# EAGLE design PiGateway2_2 (EAGLE 7.6.0)
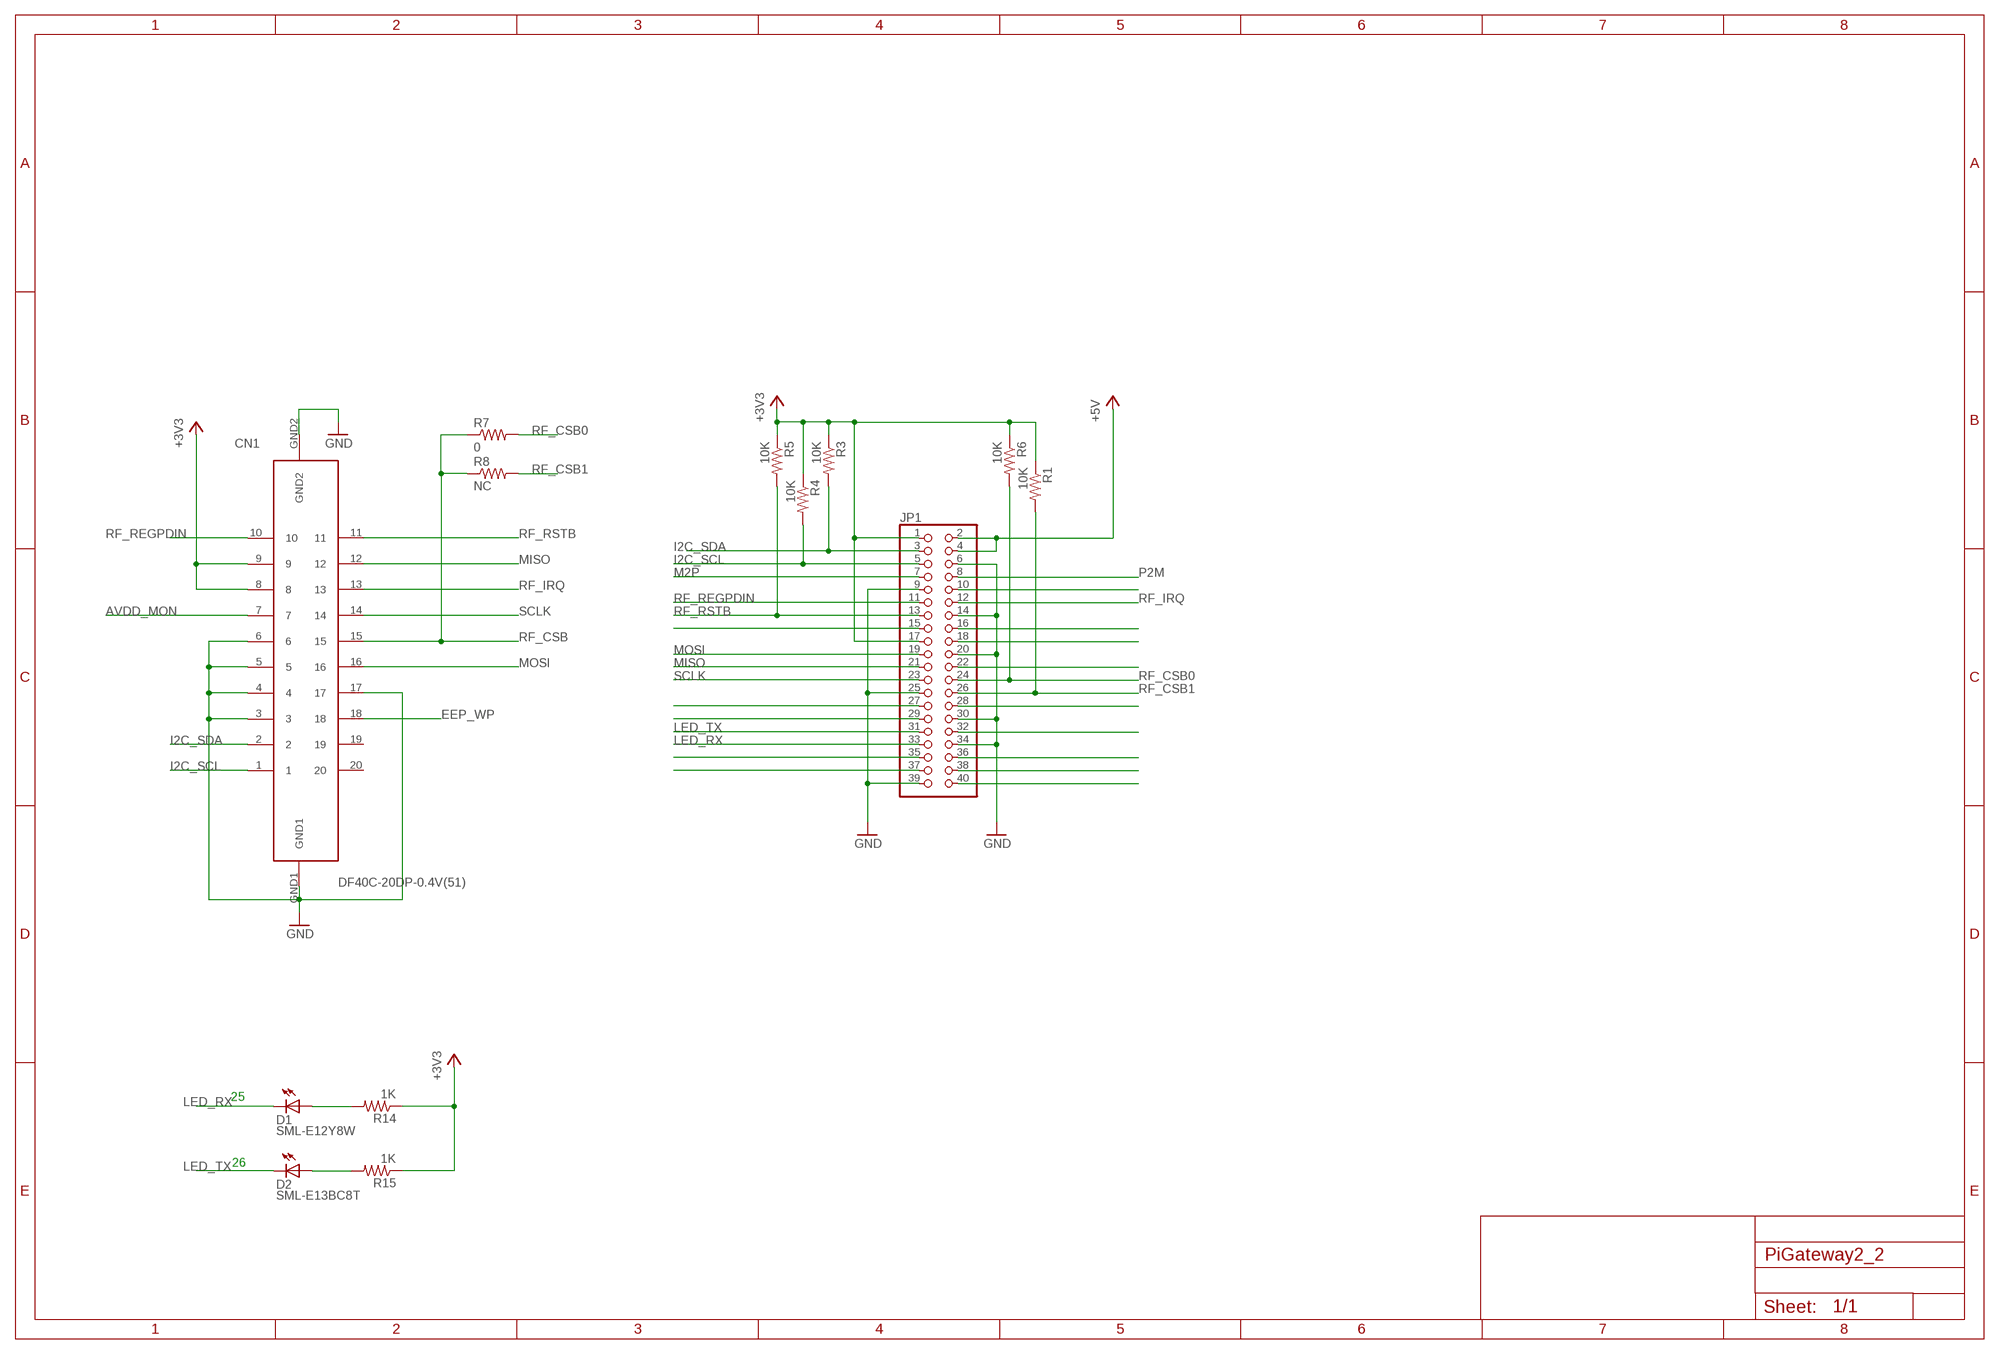
[diagram p0: schematic, sheet 1]

## Parts
CN1  DF40C-20DP-0.4V(51)  BP3596A  [BP3596A]
D1  SML-E12Y8W  SML-E1X  [SML-E1X]
D2  SML-E13BC8T  SML-E1X  [SML-E1X]
JP1  PINHD-2X20  [2X20]
R1  10K  R-US_R0402  [R0402]
R3  10K  R-US_R0402  [R0402]
R4  10K  R-US_R0402  [R0402]
R5  10K  R-US_R0402  [R0402]
R6  10K  R-US_R0402  [R0402]
R7  0  R-US_R0402  [R0402]
R8  NC  R-US_R0402  [R0402]
R14  1K  R-US_R0402  [R0402]
R15  1K  R-US_R0402  [R0402]

## Nets
+3V3: CN1.8 CN1.9 JP1.1 JP1.17 R1.1 R3.1 R4.1 R5.1 R6.1 R14.1 R15.1
+5V: JP1.2 JP1.4
AVDD_MON: CN1.7
EEP_WP: CN1.18
GND: CN1.3 CN1.4 CN1.5 CN1.6 CN1.17 CN1.GND1 CN1.GND2 JP1.6 JP1.9 JP1.14 JP1.20 JP1.25 JP1.30 JP1.34 JP1.39
I2C_SCL: CN1.1 JP1.5 R4.2
I2C_SDA: CN1.2 JP1.3 R3.2
LED_RX: D1.C JP1.33
LED_TX: D2.C JP1.31
M2P: JP1.7
MISO: CN1.12 JP1.21
MOSI: CN1.16 JP1.19
N$5: D1.A R14.2
N$6: D2.A R15.2
N$14: JP1.15
N$18: JP1.27
N$19: JP1.29
N$22: JP1.35
N$23: JP1.37
N$24: JP1.40
N$25: JP1.38
N$26: JP1.36
N$27: JP1.32
N$28: JP1.28
N$31: JP1.22
N$32: JP1.18
N$33: JP1.16
N$35: JP1.10
P2M: JP1.8
RF_CSB: CN1.15 R7.1 R8.1
RF_CSB0: JP1.24 R6.2 R7.2
RF_CSB1: JP1.26 R1.2 R8.2
RF_IRQ: CN1.13 JP1.12
RF_REGPDIN: CN1.10 JP1.11
RF_RSTB: CN1.11 JP1.13 R5.2
SCLK: CN1.14 JP1.23
Unconnected: CN1.19 CN1.20

## Notes on the sheet
- 25
- 26

## Library data of the parts
CN1 = lazurite:BP3596A
D1 D2 = lazurite:SML-E1X
JP1 = pinhead:PINHD-2X20: PIN HEADER
R1 R3-R8 R14 R15 = rcl:R-US_: RESISTOR, American symbol

## Board
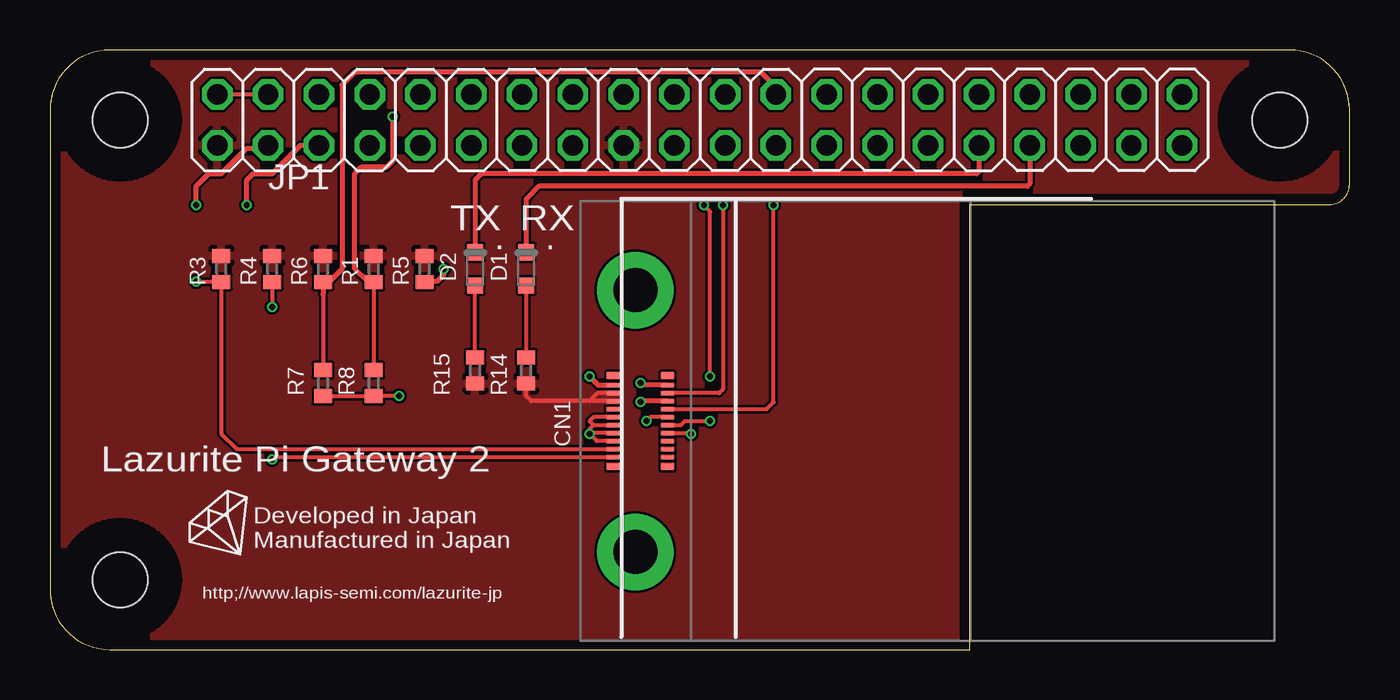
[diagram p1: board, top side]
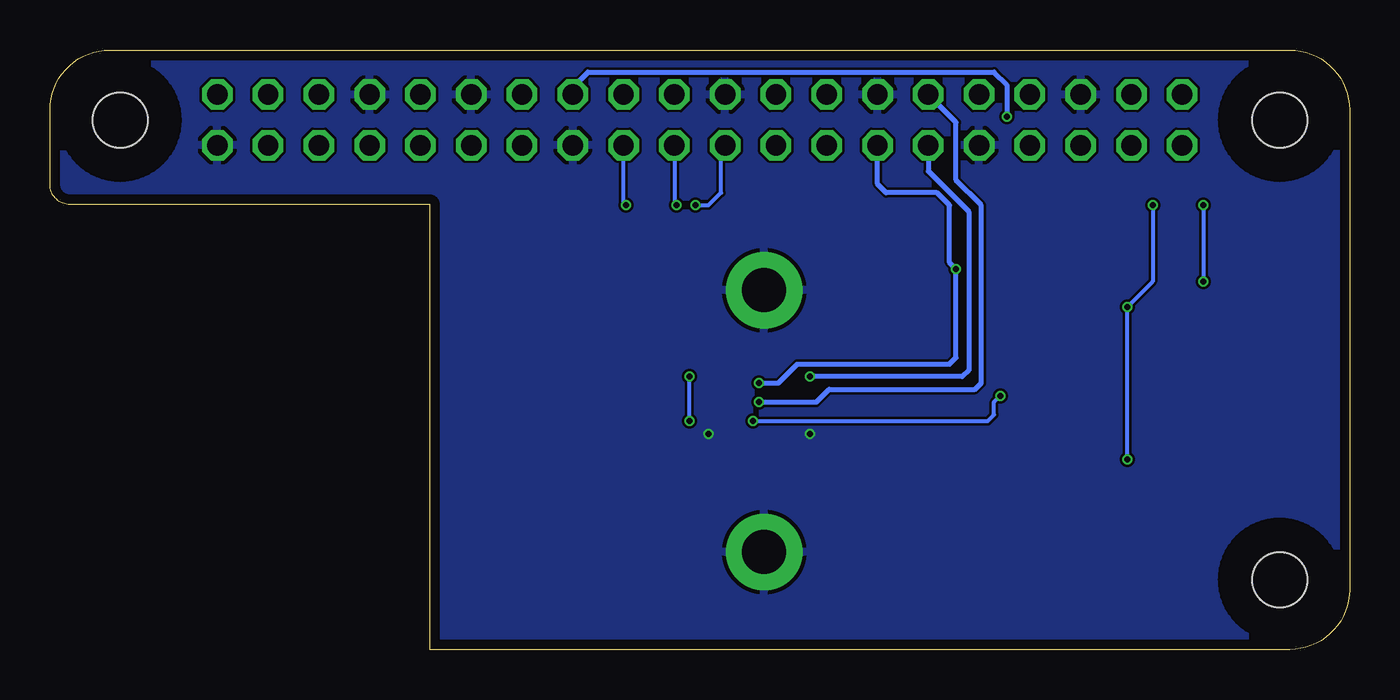
[diagram p2: board, bottom side, seen from below]

Size 65 x 30 mm. Coordinates in mm from the lower left corner, seen from the top.
Outline: 0,3 arc90 3,0 46,0 46,22.27 64,22.27 arc90 65,23.27 65,27 arc90 62,30 3,30 arc90 0,27 0,3
Copper layers (1*16): Top 0.018mm / dielectric 1.55mm / Bottom 0.018mm
Design rules "unicraft_2layer": minimum track width 0.125mm, minimum drill 0.25mm, track to track 0.125mm, track to pad 0.125mm, pad to pad 0.125mm, via to via 0.125mm, smd to smd 0mil, copper to edge 0.5mm, drill to drill 0.3mm, minimum pad ring 0.175mm, minimum via ring 0.1mm, stop-mask expansion 0mil, vias tented up to drill 0.45mm, thermal gap 0.2mm
Holes 2.75 mm at 3.5,26.5 3.5,3.5 61.5,26.5
tRestrict: area 0.5,23.5 to 6.5,29.5; area 0.5,0.5 to 6.5,6.5; area 58.5,23.5 to 64.5,29.5
bRestrict: area 0.5,0.5 to 6.5,6.5; area 0.5,23.5 to 6.5,29.5; area 58.5,23.5 to 64.5,29.5

### Footprints (pad centres in the part's own frame; a part is rotated, then mirrored left to right if it is on the bottom)
BP3596A = smd 0.23 x 0.66: 1 1.8,-1.355; 2 1.4,-1.355; 3 1,-1.355; 4 0.6,-1.355; 5 0.2,-1.355; 6 -0.2,-1.355; 7 -0.6,-1.355; 8 -1,-1.355; 9 -1.4,-1.355; 10 -1.8,-1.355; 11 -1.8,1.355; 12 -1.4,1.355; 13 -1,1.355; 14 -0.6,1.355; 15 -0.2,1.355; 16 0.2,1.355; 17 0.6,1.355; 18 1,1.355; 19 1.4,1.355; 20 1.8,1.355 | drill 2.2 pad 3.81: GND1 6.55,-0.25; GND2 -6.55,-0.25 | smd 0.35 x 0.66: NC1 2.275,-1.355; NC2 -2.275,-1.355; NC3 -2.275,1.355; NC4 2.275,1.355
SML-E1X = smd 0.8 x 0.8: A 0,-0.825; C 0,0.825
2X20 = drill 1.016 octagon: 1 -24.13,-1.27; 2 -24.13,1.27; 3 -21.59,-1.27; 4 -21.59,1.27; 5 -19.05,-1.27; 6 -19.05,1.27; 7 -16.51,-1.27; 8 -16.51,1.27; 9 -13.97,-1.27; 10 -13.97,1.27; 11 -11.43,-1.27; 12 -11.43,1.27; 13 -8.89,-1.27; 14 -8.89,1.27; 15 -6.35,-1.27; 16 -6.35,1.27; 17 -3.81,-1.27; 18 -3.81,1.27; 19 -1.27,-1.27; 20 -1.27,1.27; 21 1.27,-1.27; 22 1.27,1.27; 23 3.81,-1.27; 24 3.81,1.27; 25 6.35,-1.27; 26 6.35,1.27; 27 8.89,-1.27; 28 8.89,1.27; 29 11.43,-1.27; 30 11.43,1.27; 31 13.97,-1.27; 32 13.97,1.27; 33 16.51,-1.27; 34 16.51,1.27; 35 19.05,-1.27; 36 19.05,1.27; 37 21.59,-1.27; 38 21.59,1.27; 39 24.13,-1.27; 40 24.13,1.27
R0402 = smd 0.7 x 0.9: 1 -0.65,0; 2 0.65,0

### Placement (x,y rotation side)
CN1  29.53,11.43 270 top
D1  23.81,19.05 0 top
D2  21.27,19.05 0 top
JP1  32.5,26.5 0 top
R1  16.19,19.05 270 top
R3  8.57,19.05 270 top
R4  11.11,19.05 270 top
R5  18.73,19.05 270 top
R6  13.65,19.05 270 top
R7  13.65,13.34 90 top
R8  16.19,13.34 90 top
R14  23.81,13.97 90 top
R15  21.27,13.97 90 top
U$1  [LOGO]  6.35,5.08 0 top

### Tracks (layer width: path | path; a pad name or v marks a point on that pad's centre or on a via)
+3V3
  Top 0.2: CN1.8 26.99,12.43 | 26.99,12.43 24.08,12.43 23.81,12.7 R14.1 | CN1.9 27.39,12.83 26.99,12.43
  Top 0.406: JP1.1 8.26,25.23
  pour Top: 0.5,29.5 64.5,29.5 64.5,23 46,23 46,0.5 0.5,0.5
+5V
  Top 0.2: JP1.4 JP1.2
GND  (via drill 0.3)
  Top 0.2: CN1.6 27.19,11.63 26.99,11.43 27.19,11.23 | 27.19,11.23 CN1.5 | v26.99,10.79 26.99,11.03 27.19,11.23 | CN1.3 27.35,10.43 v26.99,10.79 | CN1.4 27.02,10.83 v26.99,10.79 | CN1.17 32.03,10.83
  Top 0.254: v32.07,10.79 32.03,10.83
  pour Bottom: 0.5,29.5 64.5,29.5 64.5,23 46,23 46,0.5 0.5,0.5
I2C_SCL  (via drill 0.3)
  Top 0.2: R4.2 v11.11,17.14 | v11.11,9.53 11.22,9.63 CN1.1
  Top 0.254: v9.84,22.23 9.84,23.5 10.16,23.81 11.11,23.81 12.53,25.23 JP1.5
  Bottom 0.2: v9.84,22.23 9.84,18.41 v11.11,17.14 v11.11,9.53
I2C_SDA  (via drill 0.3)
  Top 0.2: v7.3,18.41 8.56,18.41 R3.2 8.57,10.79 9.34,10.03 CN1.2
  Top 0.254: v7.3,22.23 7.3,23.18 7.94,23.81 8.57,23.81 9.84,25.08 10.76,25.08 JP1.3
  Bottom 0.2: v7.3,22.23 v7.3,18.41
LED_RX
  Top 0.2: D1.C 23.81,20.95
  Top 0.254: JP1.33 49.01,23.29 48.9,23.18 24.45,23.18 23.81,22.54 D1.C
LED_TX
  Top 0.2: 21.27,21.91 D2.C
  Top 0.254: JP1.31 46.47,23.93 46.35,23.81 21.59,23.81 21.27,23.5 D2.C
MISO  (via drill 0.3)
  Top 0.2: v33.66,22.23 33.66,13.02 33.47,12.83 CN1.12
  Bottom 0.2: JP1.21 33.77,22.34 v33.66,22.23
MOSI  (via drill 0.3)
  Top 0.2: CN1.16 31.55,11.23 31.75,11.43 v33.02,11.43 | v33.02,13.65 33.02,21.91 v32.7,22.23
  Bottom 0.2: v33.02,11.43 v33.02,13.65 | v32.7,22.23 32.07,22.23 31.43,22.86 31.43,25.03 JP1.19
N$5
  Top 0.2: D1.A R14.2
N$6
  Top 0.2: R15.2 D2.A
RF_CSB  (via drill 0.3)
  Top 0.2: R7.1 R8.1 16.21,12.7 v17.46,12.7 | CN1.15 30.05,11.63 v29.84,11.43
  Bottom 0.2: v29.84,11.43 18.1,11.43 17.78,11.75 17.78,12.38 v17.46,12.7
RF_CSB0
  Top 0.2: 13.67,18.41 R6.2 13.65,17.78 R7.2
  Top 0.254: 13.65,17.78 13.65,18.1 14.61,19.05 14.61,28.26 15.24,28.89 35.56,28.89 36.31,28.14 JP1.24
RF_CSB1  (via drill 0.3)
  Top 0.2: R1.2 R8.2
  Top 0.254: R1.2 16.18,18.41 15.88,18.41 15.24,19.05 15.24,23.81 15.56,24.13 16.83,24.13 17.14,24.45 v17.14,26.67
  Bottom 0.254: JP1.26 38.85,28.14 38.1,28.89 17.78,28.89 17.14,28.26 v17.14,26.67
RF_IRQ  (via drill 0.3)
  Top 0.254: CN1.13 29.57,12.43 v29.53,12.38
  Bottom 0.254: v29.53,12.38 26.67,12.38 26.04,13.02 18.73,13.02 18.41,13.34 18.41,22.23 19.68,23.5 19.68,26.39 JP1.12
RF_REGPDIN  (via drill 0.3)
  Top 0.254: v26.99,13.65 27.41,13.23 CN1.10
  Bottom 0.254: JP1.11 21.07,23.93 19.05,21.91 19.05,13.97 19.37,13.65 v26.99,13.65
RF_RSTB  (via drill 0.3)
  Top 0.254: v19.68,19.05 19.68,18.73 19.37,18.41 18.75,18.41 R5.2 | CN1.11 29.63,13.23 v29.53,13.34
  Bottom 0.254: JP1.13 23.61,23.29 23.18,22.86 20.64,22.86 20,22.23 20,19.37 v19.68,19.05 19.68,14.61 20,14.29 27.62,14.29 28.57,13.34 v29.53,13.34
SCLK  (via drill 0.3)
  Top 0.2: CN1.14 35.84,12.03 36.2,12.38 v36.2,22.23
  Bottom 0.2: v36.2,22.23 36.31,22.34 JP1.23

### Text on the board
tPlace: TX | RX | . | . | Lazurite Pi Gateway 2 | Developed in Japan / Manufactured in Japan | http;//www.lapis-semi.com/lazurite-jp